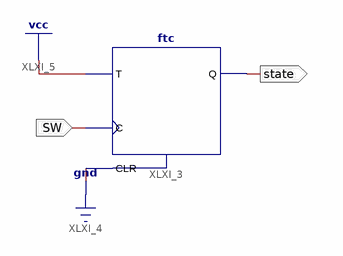
[diagram p0: schematic sheet 1]
// Xilinx ISE schematic State.sch (spartan6) as structural Verilog: 1 symbols, 2 ports
module State (
  input  SW,
  output state
);

  ftc XLXI_3 (.C(SW), .CLR(1'b0), .T(1'b1), .Q(state));
endmodule
